# EAGLE schematic brain_presunnbuddy (EAGLE 7.5.0)
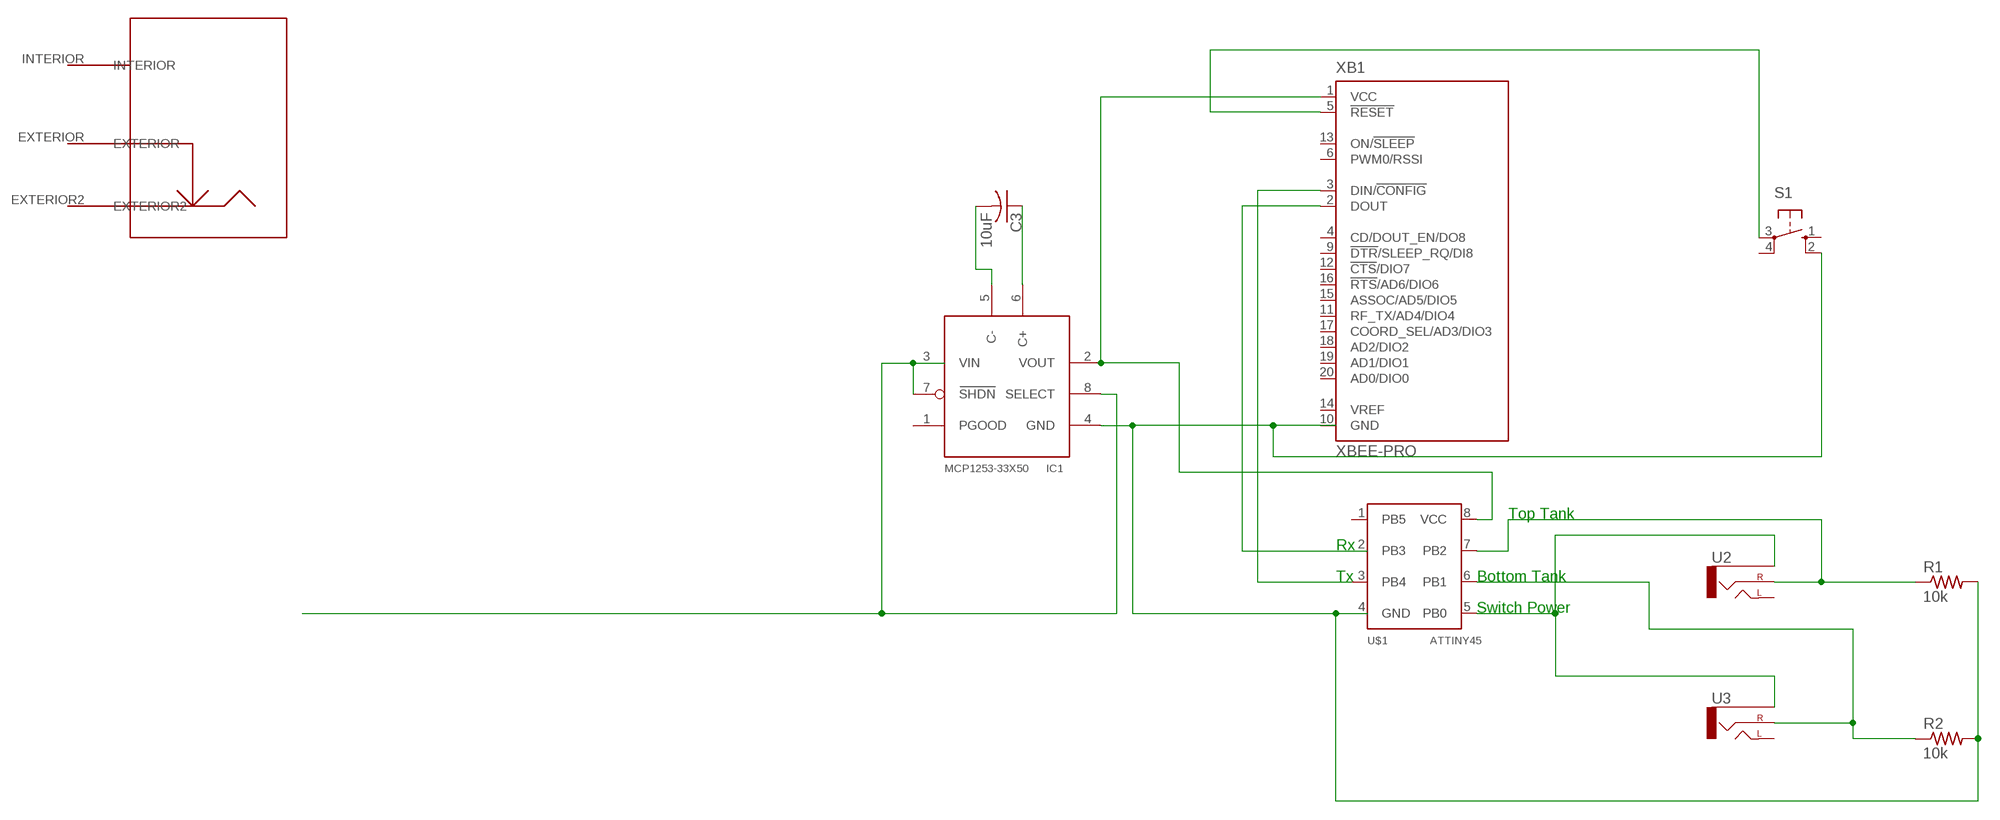
[diagram p0: schematic, sheet 1]

## Parts
C3  10uF  C-US050-045X075  [C050-045X075]
IC1  MCP1253-33X50  [MSOP8]
R1  10k  R-US_0207/10  [0207/10]
R2  10k  R-US_0207/10  [0207/10]
S1  10-XX  [B3F-10XX]
U2  AUDIO-JACKPTH  [AUDIO-JACK]
U3  AUDIO-JACKPTH  [AUDIO-JACK]
U$1  ATTINY45  [SOIC8]
U$2  SOLARCELLJACK  [SOLARCELLJACK]
XB1  XBEE-PRO  [XBEE-PRO]

## Nets
BAT: IC1.3(VIN) IC1.7(SHDN) IC1.8(SELECT)
N$1: IC1.2(VOUT) U$1.8(VCC) XB1.1(VCC)
N$2: R1.1 U2.RING(RIGHT) U$1.7(PB2)
N$3: R2.1 U3.RING(RIGHT) U$1.6(PB1)
N$4: U2.SLEEVE U3.SLEEVE U$1.5(PB0)
N$5: IC1.4(GND) R1.2 R2.2 S1.2(S1)
N$10: C3.1 IC1.6(C+)
N$11: U$1.3(PB4) XB1.3(DIN/!CONFIG)
N$12: C3.2 IC1.5(C-)
N$13: S1.3(P) XB1.5(!RESET)
N$14: XB1.2(DOUT)
Unconnected: IC1.1(PGOOD) S1.1(S) S1.4(P1) U2.TIP(LEFT) U3.TIP(LEFT) U$1.1(PB5) U$1.2(PB3) U$2.EXTERIOR U$2.EXTERIOR2 U$2.INTERIOR XB1.4(CD/DOUT_EN/DO8) XB1.6(PWM0/RSSI) XB1.9(!DTR!/SLEEP_RQ/DI8) XB1.11(RF_TX/AD4/DIO4) XB1.12(!CTS!/DIO7) XB1.13(ON/!SLEEP) XB1.14(VREF) XB1.15(ASSOC/AD5/DIO5) XB1.16(!RTS!/AD6/DIO6) XB1.17(COORD_SEL/AD3/DIO3) XB1.18(AD2/DIO2) XB1.19(AD1/DIO1) XB1.20(AD0/DIO0)

## Notes on the sheet
- Top Tank
- Rx
- Tx | Bottom Tank
- Switch Power

## Power pins joined to a net without a drawn wire
GND: U$1.4(GND) XB1.10(GND)

## Library data of the parts
C3 = rcl:C-US: CAPACITOR, American symbol
IC1 = microchip-MCP125x-xxx:MCP1253-33X50: 1Hz 3.3V / 5.0V Selectable Switching Regulator; MPN: LT3652EMSE#TRPBF; OC_NEWARK: 64R8540
R1 R2 = resistor:R-US_: RESISTOR, American symbol; MPN: LT3652EMSE#PBF; OC_NEWARK: 64R8539
S1 = switch-omron:10-XX: OMRON SWITCH; MPN: B3F-1000; OC_FARNELL: 176432; OC_NEWARK: 36M3542
U2 U3 = SparkFun-Connectors:AUDIO-JACK: 3.5mm Audio Jack Simple 3.5mm common PCB mount audio jack. SKU: PRT-08032
U$1 = attiny45:ATTINY45; OC_NEWARK: unknown
U$2 = seniordesign:SOLARCELLJACK
XB1 = maxstream:XBEE: XBee (TM) /XBee-PRO(TM) OEM RF Modules Source: MaxStream, Inc. xbee_productmanual.pdf; OC_FARNELL: 1337916; OC_NEWARK: unknown